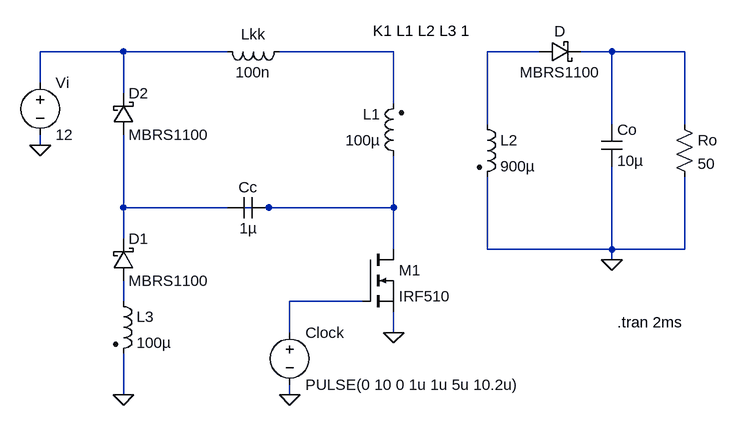
[diagram p0: schematic Flyback_clamp_bis.asc]
Flyback_clamp_bis.asc, the LTspice schematic file:
Version 4.1
SHEET 1 880 680
WIRE -368 -64 -496 -64
WIRE -208 -64 -368 -64
WIRE 48 -64 -128 -64
WIRE 272 -64 192 -64
WIRE 384 -64 336 -64
WIRE 496 -64 384 -64
WIRE -496 -16 -496 -64
WIRE -368 0 -368 -64
WIRE 48 16 48 -64
WIRE 192 48 192 -64
WIRE 384 48 384 -64
WIRE 496 48 496 -64
WIRE -496 80 -496 64
WIRE -368 176 -368 64
WIRE -208 176 -368 176
WIRE -144 176 -192 176
WIRE 48 176 48 96
WIRE 48 176 -144 176
WIRE -368 224 -368 176
WIRE 48 240 48 176
WIRE 192 240 192 128
WIRE 384 240 384 112
WIRE 384 240 192 240
WIRE 496 240 496 128
WIRE 496 240 384 240
WIRE 384 256 384 240
WIRE -368 320 -368 288
WIRE 0 320 -112 320
WIRE -112 368 -112 320
WIRE 48 368 48 336
WIRE -368 464 -368 400
WIRE -112 464 -112 448
FLAG -496 80 0
FLAG 48 368 0
FLAG 384 256 0
FLAG -112 464 0
FLAG -368 464 0
SYMBOL cap 368 48 R0
SYMATTR InstName Co
SYMATTR Value 10µ
SYMBOL res 480 32 R0
SYMATTR InstName Ro
SYMATTR Value 50
SYMBOL voltage -112 352 R0
WINDOW 123 0 0 Left 2
WINDOW 39 0 0 Left 2
SYMATTR InstName Clock
SYMATTR Value PULSE(0 10 0 1u 1u 5u 10.2u)
SYMBOL voltage -496 -32 R0
WINDOW 123 0 0 Left 2
WINDOW 39 0 0 Left 2
SYMATTR InstName Vi
SYMATTR Value 12
SYMBOL schottky 272 -80 M90
WINDOW 0 0 32 VBottom 2
WINDOW 3 32 32 VTop 2
SYMATTR InstName D
SYMATTR Value MBRS1100
SYMATTR Description Diode
SYMATTR Type diode
SYMBOL ind2 64 112 R180
WINDOW 0 36 80 Left 2
WINDOW 3 36 40 Left 2
SYMATTR InstName L1
SYMATTR Value 100µ
SYMBOL ind2 176 32 R0
SYMATTR InstName L2
SYMATTR Value 900µ
SYMBOL nmos 0 240 R0
SYMATTR InstName M1
SYMATTR Value IRF510
SYMBOL schottky -384 288 M180
WINDOW 0 24 64 Left 2
WINDOW 3 24 0 Left 2
SYMATTR InstName D1
SYMATTR Value MBRS1100
SYMATTR Description Diode
SYMATTR Type diode
SYMBOL cap -144 160 R90
WINDOW 0 0 32 VBottom 2
WINDOW 3 32 32 VTop 2
SYMATTR InstName Cc
SYMATTR Value 1µ
SYMBOL ind2 -384 304 R0
SYMATTR InstName L3
SYMATTR Value 100µ
SYMBOL schottky -384 64 M180
WINDOW 0 24 64 Left 2
WINDOW 3 24 0 Left 2
SYMATTR InstName D2
SYMATTR Value MBRS1100
SYMATTR Description Diode
SYMATTR Type diode
SYMBOL ind -112 -80 R90
WINDOW 0 5 56 VBottom 2
WINDOW 3 32 56 VTop 2
SYMATTR InstName Lkk
SYMATTR Value 100n
TEXT 392 352 Left 2 !.tran 2ms
TEXT 16 -96 Left 2 !K1 L1 L2 L3 1

The netlist it stands for:
* Flyback_clamp_bis.asc
Co N004 0 10µ
Ro N004 0 50
V§Clock N008 0 PULSE(0 10 0 1u 1u 5u 10.2u)
Vi N001 0 12
D N003 N004 MBRS1100
L1 N006 N002 100µ
L2 N003 0 900µ
M1 N006 N008 0 0 IRF510
D1 N007 N005 MBRS1100
Cc N006 N005 1µ
L3 N007 0 100µ
D2 N005 N001 MBRS1100
Lkk N002 N001 100n
.model D D
.lib standard.dio
.model NMOS NMOS
.model PMOS PMOS
.lib standard.mos
.tran 2ms
K1 L1 L2 L3 1
.backanno
.end